# EAGLE design HVDCS_C8051F350_32TQFP (EAGLE 9.6.2)
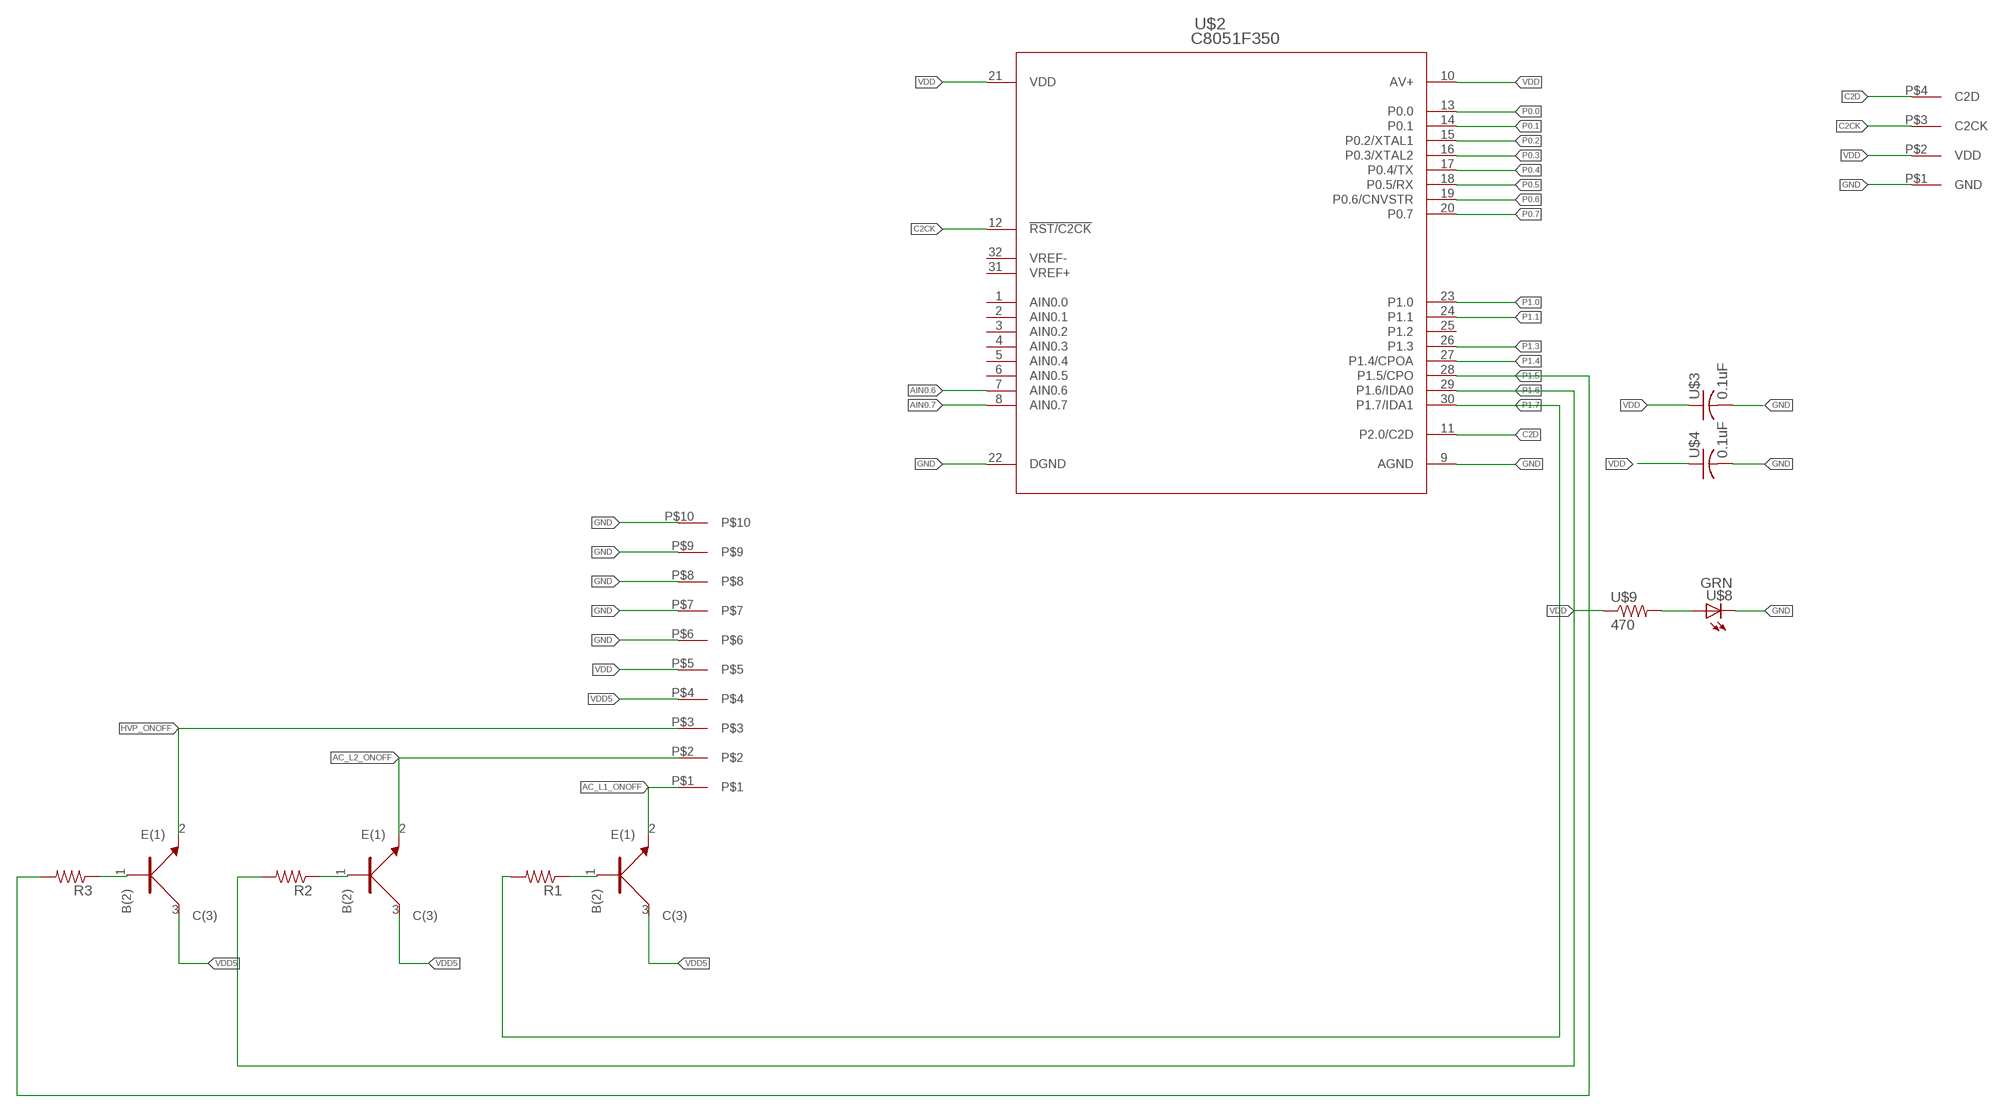
[diagram p0: schematic, sheet 1]

## Parts
R1  R_0402  [0402]
R2  R_0402  [0402]
R3  R_0402  [0402]
U1  NPN  BC846BW  [SOT323]
U2  NPN  BC846BW  [SOT323]
U3  NPN  BC846BW  [SOT323]
U$2  C8051F350  [QFP32-7X7-0P8MM]
U$3  C_0805_0.1UF  [C_0805_0.1UF]
U$4  C_0805_0.1UF  [C_0805_0.1UF]
U$5  1_X_10_HEADER_GENERIC_.1INCH  [HEADER_1_X_10_.1_INCH]
U$8  LED_0805_GREEN  [LED_0805_GREEN]
U$9  R_0805_470  [R_0805_470]
U$13  C2D  [1X4_.1_INCH_HEADER]

## Nets
AC_L1_ONOFF: U1.2(E(1)) U$5.P$1
AC_L2_ONOFF: U2.2(E(1)) U$5.P$2
AIN0.6: U$2.7(AIN0.6)
AIN0.7: U$2.8(AIN0.7)
C2CK: U$2.12(!RST/C2CK) U$13.P$3(C2CK)
C2D: U$2.11(P2.0/C2D) U$13.P$4(C2D)
GND: U$2.9(AGND) U$2.22(DGND) U$3.2 U$4.2 U$5.P$6 U$5.P$7 U$5.P$8 U$5.P$9 U$5.P$10 U$8.C U$13.P$1(GND)
HVP_ONOFF: U3.2(E(1)) U$5.P$3
N$1: U$8.A U$9.2
N$2: R1.P$1 U1.1(B(2))
N$3: R2.P$1 U2.1(B(2))
N$4: R3.P$1 U3.1(B(2))
P0.0: U$2.13(P0.0)
P0.1: U$2.14(P0.1)
P0.2: U$2.15(P0.2/XTAL1)
P0.3: U$2.16(P0.3/XTAL2)
P0.4: U$2.17(P0.4/TX)
P0.5: U$2.18(P0.5/RX)
P0.6: U$2.19(P0.6/CNVSTR)
P0.7: U$2.20(P0.7)
P1.0: U$2.23(P1.0)
P1.1: U$2.24(P1.1)
P1.3: U$2.26(P1.3)
P1.4: U$2.27(P1.4/CPOA)
P1.5: R3.P$2 U$2.28(P1.5/CPO)
P1.6: R2.P$2 U$2.29(P1.6/IDA0)
P1.7: R1.P$2 U$2.30(P1.7/IDA1)
VDD: U$2.10(AV+) U$2.21(VDD) U$3.1 U$4.1 U$5.P$5 U$9.1 U$13.P$2(VDD)
VDD5: U1.3(C(3)) U2.3(C(3)) U3.3(C(3)) U$5.P$4
Unconnected: U$2.1(AIN0.0) U$2.2(AIN0.1) U$2.3(AIN0.2) U$2.4(AIN0.3) U$2.5(AIN0.4) U$2.6(AIN0.5) U$2.25(P1.2) U$2.31(VREF+) U$2.32(VREF-)

## Library data of the parts
R1-R3 = 3D_MIG_Controller:R_0402
U1-U3 = 3D_MIG_Controller:BC846BW: Bipolar (BJT) Transistor NPN 100MHz Surface Mount SOT-323; PARTNO: BC846BW_NPN
U$2 = Silicone_lab_f350:C8051F350
U$3 U$4 = 3D_MIG_Controller:C_0805_0.1UF
U$5 = 3D_MIG_Controller:1_X_10_HEADER_GENERIC_.1INCH
U$8 = 3D_MIG_Controller:LED_0805_GREEN
U$9 = 3D_MIG_Controller:R_0805_470
U$13 = 3D_MIG_Controller:C2D

## Board
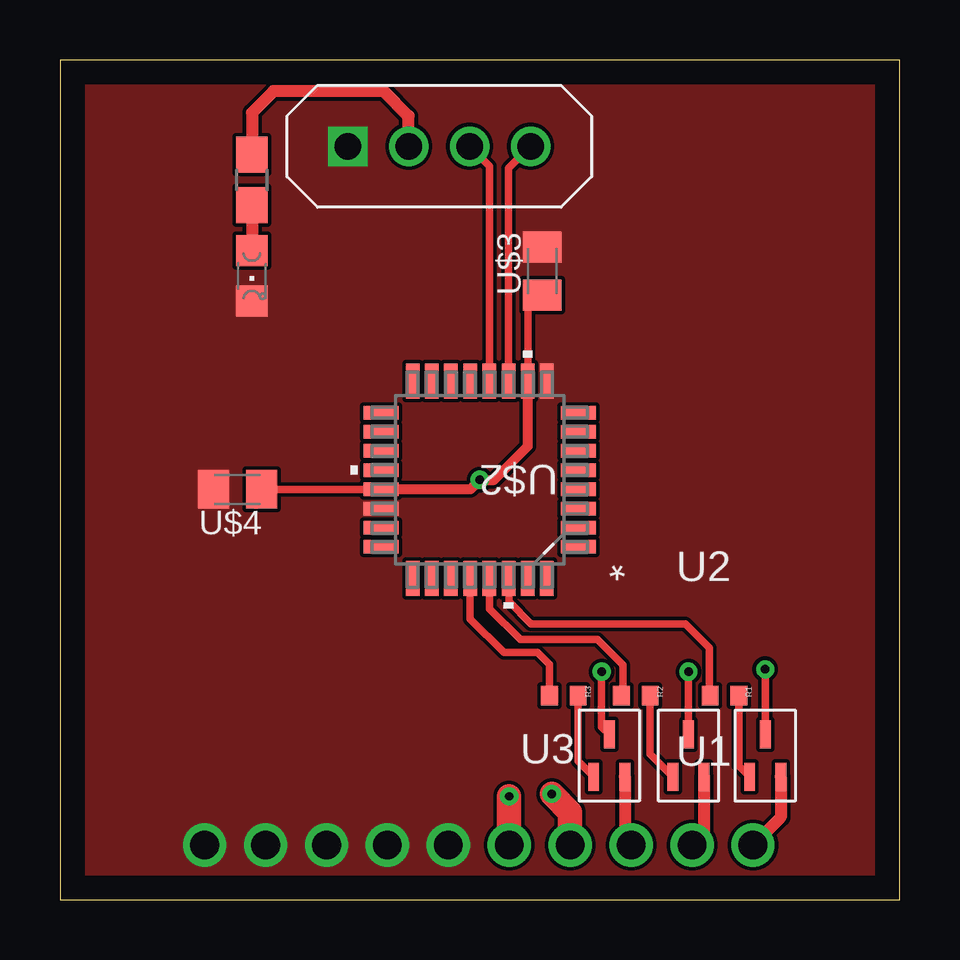
[diagram p1: board, top side]
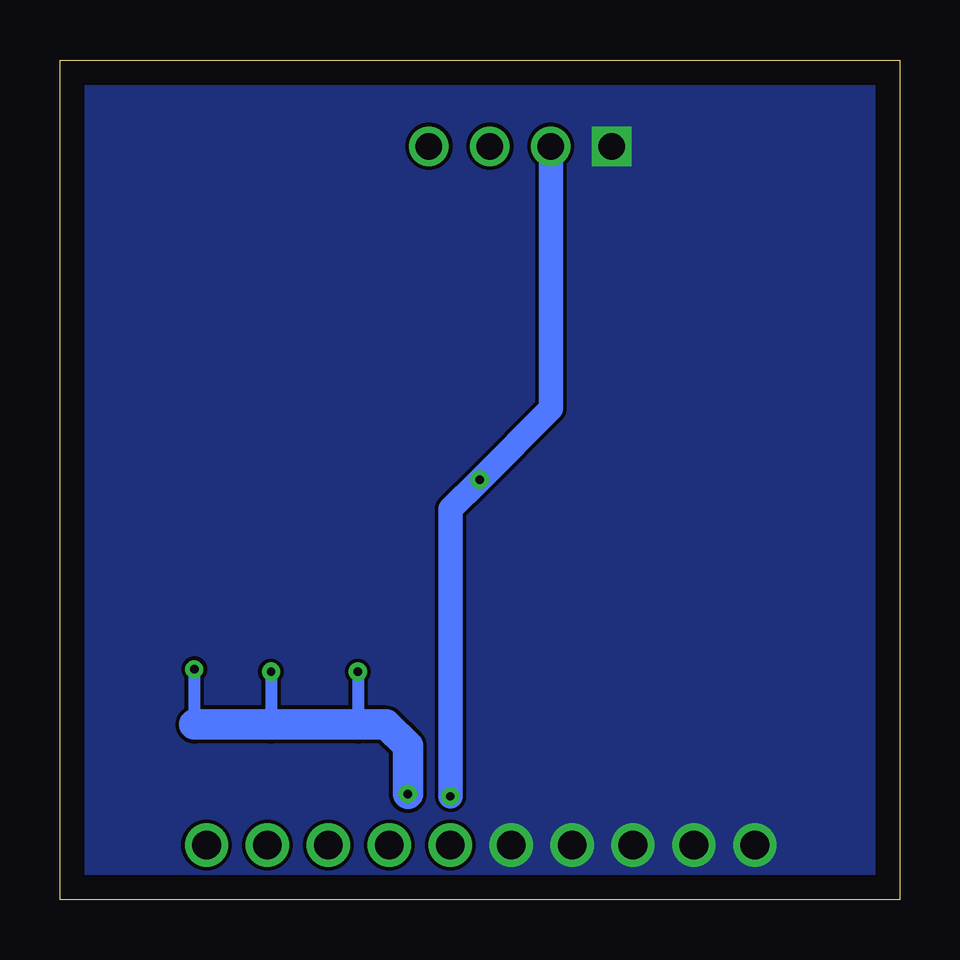
[diagram p2: board, bottom side, seen from below]

Size 35 x 35 mm. Coordinates in mm from the lower left corner, seen from the top.
Outline: 0,0 35,0 35,35 0,35 0,0
Copper layers (1*16): Top 0.035mm / dielectric 1.5mm / Bottom 0.035mm
Design rules "default": minimum track width 6mil, minimum drill 0.35mm, track to track 6mil, track to pad 6mil, pad to pad 6mil, via to via 6mil, smd to smd 6mil, copper to edge 40mil, drill to drill 6mil, minimum pad ring 10mil, minimum via ring 8mil, stop-mask expansion 4mil, vias tented up to drill 0mil, thermal gap 10mil

### Footprints (pad centres in the part's own frame; a part is rotated, then mirrored left to right if it is on the bottom)
0402 = smd 0.8 x 0.7: P$1 0,0.6; P$2 0,-0.6
SOT323 = smd 0.457 x 1.168: 1 -0.65,-0.876; 2 0.65,-0.876; 3 0,0.876
QFP32-7X7-0P8MM = smd 1.473 x 0.559: 1 -4.115,2.8; 2 -4.115,2; 3 -4.115,1.2; 4 -4.115,0.4; 5 -4.115,-0.4; 6 -4.115,-1.2; 7 -4.115,-2; 8 -4.115,-2.8; 17 4.115,-2.8; 18 4.115,-2; 19 4.115,-1.2; 20 4.115,-0.4; 21 4.115,0.4; 22 4.115,1.2; 23 4.115,2; 24 4.115,2.8 | smd 0.559 x 1.473: 9 -2.8,-4.115; 10 -2,-4.115; 11 -1.2,-4.115; 12 -0.4,-4.115; 13 0.4,-4.115; 14 1.2,-4.115; 15 2,-4.115; 16 2.8,-4.115; 25 2.8,4.115; 26 2,4.115; 27 1.2,4.115; 28 0.4,4.115; 29 -0.4,4.115; 30 -1.2,4.115; 31 -2,4.115; 32 -2.8,4.115
C_0805_0.1UF = smd 1.3 x 1.6: 1 -1,0; 2 1,0
HEADER_1_X_10_.1_INCH = drill 1.2 pad 1.6: P$1 -24.13,-1.27; P$2 -21.59,-1.27; P$3 -19.05,-1.27; P$4 -16.51,-1.27; P$5 -13.97,-1.27; P$6 -11.43,-1.27; P$7 -8.89,-1.27; P$8 -6.35,-1.27; P$9 -3.81,-1.27; P$10 -1.27,-1.27
LED_0805_GREEN = smd 1.3 x 1.3: A 0,-1.05; C 0,1.05
R_0805_470 = smd 1.5 x 1.3: 1 -1.052,0; 2 1.052,0
1X4_.1_INCH_HEADER = drill 1.1 square: P$1 0,0 | drill 1.1: P$2 2.54,0; P$3 5.08,0; P$4 7.62,0

### Placement (x,y rotation side)
R1  27.7,8.5 270 top
R2  24,8.5 270 top
R3  21,8.5 270 top
U1  29.4,6 0 top
U2  26.2,6 0 top
U3  22.9,6 0 top
U$2  17.5,17.5 180 top
U$3  20.1,26.2 90 top
U$4  7.4,17.1 180 top
U$5  4.76,1 180 top
U$8  8,26 180 top
U$9  8,30 270 top
U$13  12,31.4 0 top

### Tracks (layer width: path | path; a pad name or v marks a point on that pad's centre or on a via)
AC_L1_ONOFF
  Top 0.508: U1.2 30.05,3.43 U$5.P$1
AC_L2_ONOFF
  Top 0.508: U2.2 26.85,2.77 U$5.P$2
C2CK
  Top 0.305: U$2.12 17.9,30.58 U$13.P$3
C2D
  Top 0.305: U$2.11 18.7,30.48 U$13.P$4
GND
  pour Bottom (no thermals): 0,0 0,35 35,35 35,0
  pour Top (no thermals): 0,35 35,35 35,0 0,0
HVP_ONOFF
  Top 0.508: U3.2 23.55,2.53 U$5.P$3
N$1
  Top 0.508: U$9.2 U$8.A
N$2
  Top 0.305: U1.1 28.3,5.57 R1.P$1
N$3
  Top 0.305: U2.1 24.6,6.07 R2.P$1
N$4
  Top 0.305: U3.1 21.6,5.77 R3.P$1
P1.5
  Top 0.305: R3.P$2 20.4,9.8 19.9,10.3 18.5,10.3 17.1,11.7 U$2.28
P1.6
  Top 0.305: U$2.29 17.92,13.37 17.92,12.12 19.2,10.84 22.41,10.84 23.46,9.78 23.46,8.56 R2.P$2
P1.7
  Top 0.305: U$2.30 18.72,13.37 18.72,12.42 19.64,11.5 26.07,11.5 27.08,10.48 27.08,8.52 R1.P$2
VDD  (via drill 0.35)
  Top 0.305: U$2.10 19.5,24.6 U$3.1 | U$2.21 13.2,17.1 U$4.1
  Top 0.406: 13.2,17.1 17.1,17.1 v17.5,17.5 18.1,17.5 19.5,18.9 U$2.10
  Top 0.508: U$13.P$2 14.54,32.66 13.5,33.7 8.9,33.7 8,32.8 U$9.1
  Top 1.016: U$5.P$5 v18.73,4.3
  Bottom 1.016: v18.73,4.3 18.73,16.27 v17.5,17.5 14.54,20.46 U$13.P$2
VDD5  (via drill 0.35)
  Top 0.305: U3.3 22.58,7.2 v22.58,9.5 | U2.3 v26.2,9.5 | U1.3 v29.4,9.6
  Top 1.016: U$5.P$4 21.27,3.63 v20.5,4.4
  Bottom 0.508: v22.58,9.5 v22.57,9.49 22.57,7.3 | v26.2,9.5 26.2,7.3 | v29.4,9.6 29.4,7.3
  Bottom 1.27: v20.5,4.4 20.5,6.4 21.4,7.3 22.57,7.3 26.2,7.3 29.4,7.3